# Altium schematic sheet MOTOR.SchDoc
size A3
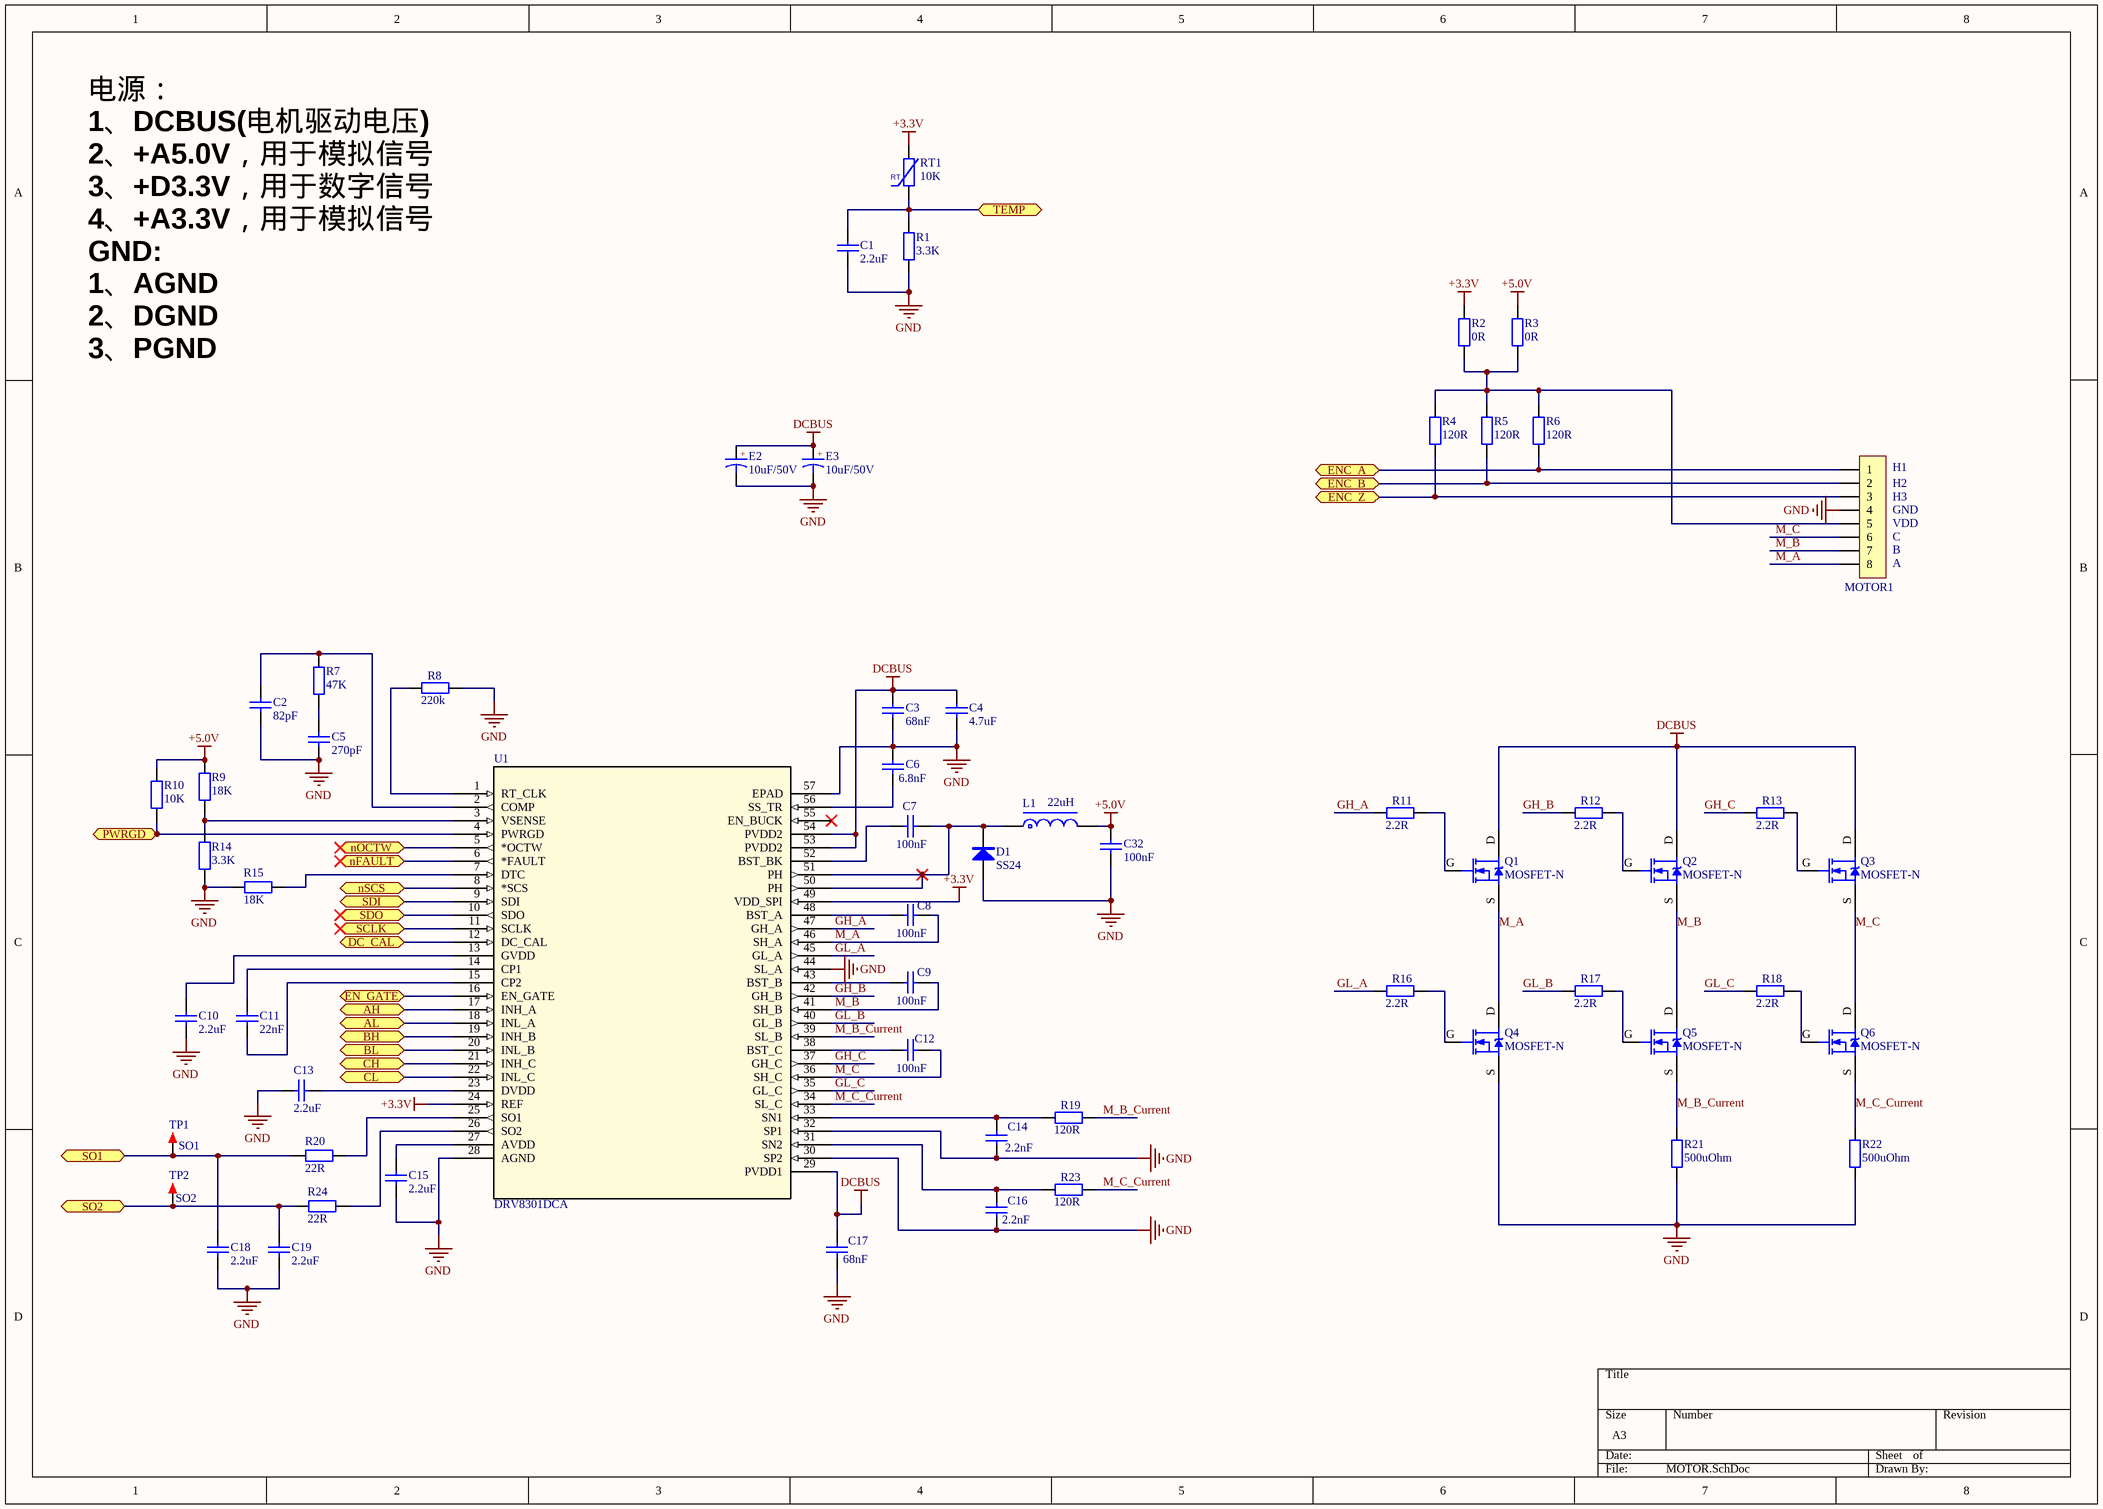
[diagram p0: MOTOR.SchDoc]

## Parts
C1  2.2uF  [C0603_M]
C2  82pF  [C0603_M]
C3  68nF  [C0603_M]
C4  4.7uF  [C0603_M]
C5  270pF  [C0603_M]
C6  6.8nF  [C0603_M]
C7  100nF  [C0603_M]
C8  100nF  [C0603_M]
C9  100nF  [C0603_M]
C10  2.2uF  [C0603_M]
C11  22nF  [C0603_M]
C12  100nF  [C0603_M]
C13  2.2uF  [C0603_M]
C14  2.2nF  [C0603_M]
C15  2.2uF  [C0603_M]
C16  2.2nF  [C0603_M]
C17  68nF  [C0603_M]
C18  2.2uF  [C0603_M]
C19  2.2uF  [C0603_M]
C32  100nF  [C0805_M]
D1  SS24  [SMA]
E2  10uF/50V  [CE C(5*5.4)]
E3  10uF/50V  [CE C(5*5.4)]
L1  22uH  [L-SMD-0420]
MOTOR1  HDR-1X8  [PH2.0-W-8P]  (value not drawn)
Q1  MOSFET-N  [DFN5_5X6_ONS]
Q2  MOSFET-N  [DFN5_5X6_ONS]
Q3  MOSFET-N  [DFN5_5X6_ONS]
Q4  MOSFET-N  [DFN5_5X6_ONS]
Q5  MOSFET-N  [DFN5_5X6_ONS]
Q6  MOSFET-N  [DFN5_5X6_ONS]
R1  3.3K  [R0603_M]
R2  0R  [R0603_M]
R3  0R  [R0603_M]
R4  120R  [R0603_M]
R5  120R  [R0603_M]
R6  120R  [R0603_M]
R7  47K  [R0603_M]
R8  220k  [R0603_M]
R9  18K  [R0603_M]
R10  10K  [R0603_M]
R11  2.2R  [R0603_M]
R12  2.2R  [R0603_M]
R13  2.2R  [R0603_M]
R14  3.3K  [R0603_M]
R15  18K  [R0603_M]
R16  2.2R  [R0603_M]
R17  2.2R  [R0603_M]
R18  2.2R  [R0603_M]
R19  120R  [R0603_M]
R20  22R  [R0603_M]
R21  500uOhm  [R2512_M]
R22  500uOhm  [R2512_M]
R23  120R  [R0603_M]
R24  22R  [R0603_M]
RT1  10K  [R0805-HP_L]
TP1  SO1  [TEST 0.8]
TP2  SO2  [TEST 0.8]
U1  DRV8301DCA  [DRV8301DCA]

## Ports
AH (bidir), AL (bidir), BH (bidir), BL (bidir), CH (bidir), CL (bidir), DC_CAL (bidir), EN_GATE (bidir), ENC_A (bidir), ENC_B (bidir), ENC_Z (bidir), nFAULT (bidir), nOCTW (bidir), nSCS (bidir), PWRGD (bidir), SCLK (bidir), SDI (bidir), SDO (bidir), SO1 (bidir), SO2 (bidir), TEMP (bidir)

## Nets
+3.3V: R2.1 RT1.2 U1.24(REF) U1.49(VDD_SPI)
+5.0V: C32.1 L1.2 R3.1 R9.1 R10.1
DCBUS: C3.1 C4.1 C17.2 E2.1 E3.1 Q1.D Q2.D Q3.D U1.29(PVDD1) U1.53(PVDD2) U1.54(PVDD2)
GND: C1.2 C2.2 C3.2 C4.2 C5.2 C6.1 C10.2 C13.1 C14.1 C15.2 C16.1 C17.1 C18.2 C19.2 C32.2 D1.1(A) E2.2 E3.2 MOTOR1.4 Q4.S R1.2 R8.1 R14.2 R15.1 R21.1 R22.1 U1.28(AGND) U1.30(SP2) U1.32(SP1) U1.44(SL_A) U1.57(EPAD)
AH: U1.17(INH_A) ; port AH
AL: U1.18(INL_A) ; port AL
BH: U1.19(INH_B) ; port BH
BL: U1.20(INL_B) ; port BL
CH: U1.21(INH_C) ; port CH
CL: U1.22(INL_C) ; port CL
DC_CAL: U1.12(DC_CAL) ; port DC_CAL
EN_GATE: U1.16(EN_GATE) ; port EN_GATE
ENC_A: MOTOR1.1 R6.2 ; port ENC_A
ENC_B: MOTOR1.2 R5.2 ; port ENC_B
ENC_Z: MOTOR1.3 R4.2 ; port ENC_Z
GH_A: R11.2 U1.47(GH_A)
GH_B: R12.2 U1.42(GH_B)
GH_C: R13.2 U1.37(GH_C)
GL_A: R16.2 U1.45(GL_A)
GL_B: R17.2 U1.40(GL_B)
GL_C: R18.2 U1.35(GL_C)
M_A: C8.1 MOTOR1.8 Q1.S Q4.D U1.46(SH_A)
M_B: C9.1 MOTOR1.7 Q2.S Q5.D U1.41(SH_B)
M_B_Current: Q5.S R19.1 R21.2 U1.39(SL_B)
M_C: C12.1 MOTOR1.6 Q3.S Q6.D U1.36(SH_C)
M_C_Current: Q6.S R22.2 R23.1 U1.34(SL_C)
nFAULT: U1.6(*FAULT) ; port nFAULT
nOCTW: U1.5(*OCTW) ; port nOCTW
nSCS: U1.8(*SCS) ; port nSCS
PWRGD: R10.2 U1.4(PWRGD) ; port PWRGD
SCLK: U1.11(SCLK) ; port SCLK
SDI: U1.9(SDI) ; port SDI
SDO: U1.10(SDO) ; port SDO
SO1: C18.1 R20.1 TP1.1 ; port SO1
SO2: C19.1 R24.1 TP2.1 ; port SO2
TEMP: C1.1 R1.1 RT1.1 ; port TEMP
NetC2_1: C2.1 R7.1 U1.2(COMP)
NetC5_1: C5.1 R7.2
NetC6_2: C6.2 U1.56(SS_TR)
NetC7_1: C7.1 D1.2(K) L1.1 U1.50(PH) U1.51(PH)
NetC7_2: C7.2 U1.52(BST_BK)
NetC8_2: C8.2 U1.48(BST_A)
NetC9_2: C9.2 U1.43(BST_B)
NetC10_1: C10.1 U1.13(GVDD)
NetC11_1: C11.1 U1.14(CP1)
NetC11_2: C11.2 U1.15(CP2)
NetC12_2: C12.2 U1.38(BST_C)
NetC13_2: C13.2 U1.23(DVDD)
NetC14_2: C14.2 R19.2 U1.33(SN1)
NetC15_1: C15.1 U1.27(AVDD)
NetC16_2: C16.2 R23.2 U1.31(SN2)
NetMOTOR1_5: MOTOR1.5 R2.2 R3.2 R4.1 R5.1 R6.1
NetQ1_G: Q1.G R11.1
NetQ2_G: Q2.G R12.1
NetQ3_G: Q3.G R13.1
NetQ4_G: Q4.G R16.1
NetQ5_G: Q5.G R17.1
NetQ6_G: Q6.G R18.1
NetR8_2: R8.2 U1.1(RT_CLK)
NetR9_2: R9.2 R14.1 U1.3(VSENSE)
NetR15_2: R15.2 U1.7(DTC)
NetR20_2: R20.2 U1.25(SO1)
NetR24_2: R24.2 U1.26(SO2)

Not connected (* = marked no-connect by the designer): U1 55(EN_BUCK)*

## Notes on the sheet
- 电源：
  1、DCBUS(电机驱动电压)
  2、+A5.0V，用于模拟信号
  3、+D3.3V，用于数字信号
  4、+A3.3V，用于模拟信号
  GND:
  1、AGND
  2、DGND
  3、PGND
- (near MOTOR1) GND
- (near MOTOR1) H3
- (near MOTOR1) H2
- (near MOTOR1) H1
- (near MOTOR1) A
- (near MOTOR1) B
- (near MOTOR1) C
- (near MOTOR1) VDD
- (in symbol CE_SMD) +

## Library data of the parts
C1-C19 C32 = C: 贴片电容/MLCC电容; BOM名称: 无极性贴片电容; 联系卖家，免费查找封装: 唯一出售店铺网址https://shop463601444.taobao.com
D1 = 1N4007: 整流二极管; 以赠品形式获赠本封装库的买家，还可联系卖家免费指导AD软件使用: 封装库来自淘宝卖家ID：黄晶宝石; 联系卖家 免费查找封装: 唯一出售店铺网址https://shop463601444.taobao.com; BOM名称: 整流二极管
E2 E3 = CE_SMD: 贴片电解电容; 联系卖家，免费查找封装: 唯一出售店铺网址https://shop463601444.taobao.com; BOM名称: 贴片电解电容
L1 = L-Molding Choke: 一体成型电感; 联系卖家，免费查找封装: 唯一出售店铺网址https://shop463601444.taobao.com; BOM名称: 一体成型电感
MOTOR1 = Header 8: 8P接插件; 以赠品形式获赠本封装库的买家，还可联系卖家免费指导AD软件使用: 联系卖家 免费技术支持; 联系卖家，免费查找封装: 唯一出售店铺网址https://shop463601444.taobao.com
Q1-Q6 = MOSFET-N: N-Channel MOSFET; PackageDocument: 1995/1996; Published: 8-Jun-2000; LatestRevisionDate: 17-Jul-2002; LatestRevisionNote: Re-released for DXP Platform.; PackageReference: E3; Publisher: Altium Limited
R1-R24 = R: 贴片电阻; 联系卖家，免费查找封装: 唯一出售店铺网址https://shop463601444.taobao.com; BOM名称: 贴片电阻
RT1 = RT: 热敏电阻; BOM名称: 压敏电阻; 联系卖家，免费查找封装: 唯一出售店铺网址https://shop463601444.taobao.com
TP1 TP2 = TEST: 测试点; 联系卖家，免费查找封装: 唯一出售店铺网址https://shop463601444.taobao.com; 封装库来自淘宝卖家ID:黄晶宝石: 其他店铺购入均为盗版假冒封装库，请立即申请退款，本店现金奖励20~200元; BOM名称: 测试点
U1 = DRV8301DCA: No Description Available; Mfr_Name: Texas Instruments; Copyright: Copyright (C) 2021 Ultra Librarian. All rights reserved.; Manufacturer_Part_Number: DRV8301DCA; RefDes: RefDes; Type: DEV